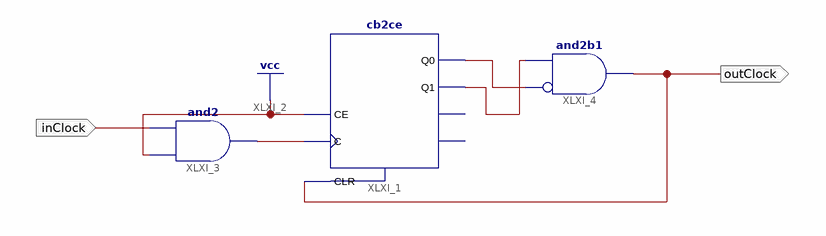
[diagram p0: schematic sheet 1]
// Xilinx ISE schematic div2.sch (spartan6) as structural Verilog: 3 symbols, 2 ports
module div2 (
  input  inClock,
  output outClock
);

  wire XLXN_2, XLXN_5, XLXN_6;

  cb2ce XLXI_1 (.C(XLXN_2), .CE(1'b1), .CLR(outClock), .Q0(XLXN_5), .Q1(XLXN_6));  // open: CEO, TC
  and XLXI_3 (XLXN_2, 1'b1, inClock);
  and XLXI_4 (outClock, ~XLXN_5, XLXN_6);  // and2b1
endmodule
